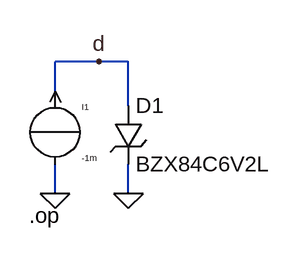
[diagram p0: schematic diode_kenn.asc]
diode_kenn.asc, the LTspice schematic file:
Version 4
SHEET 1 880 680
WIRE 208 96 160 96
WIRE 240 96 208 96
WIRE 160 128 160 96
WIRE 240 144 240 96
WIRE 160 240 160 208
WIRE 240 240 240 208
FLAG 240 240 0
FLAG 160 240 0
FLAG 208 96 d
SYMBOL zener 224 144 R0
SYMATTR InstName D1
SYMATTR Value BZX84C6V2L
SYMATTR Description Diode
SYMATTR Type diode
SYMBOL source-I 160 128 R0
SYMATTR InstName I1
SYMATTR Value -1m
TEXT 132 264 Left 2 !.op

The netlist it stands for:
* diode_kenn.asc
D1 d 0 BZX84C6V2L
I1 0 d -1m
.model D D
.lib standard.dio
.op
.backanno
.end